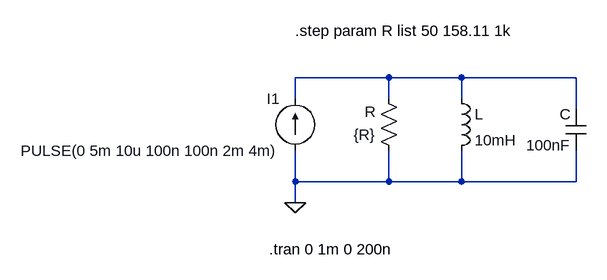
[diagram p0: schematic 06_RLC_paralelo.asc]
06_RLC_paralelo.asc, the LTspice schematic file:
Version 4
SHEET 1 880 680
WIRE 208 112 64 112
WIRE 320 112 208 112
WIRE 496 112 320 112
WIRE 64 144 64 112
WIRE 208 144 208 112
WIRE 320 144 320 112
WIRE 496 160 496 112
WIRE 64 272 64 224
WIRE 208 272 208 224
WIRE 208 272 64 272
WIRE 320 272 320 224
WIRE 320 272 208 272
WIRE 496 272 496 224
WIRE 496 272 320 272
WIRE 64 304 64 272
FLAG 64 304 0
SYMBOL ind 304 128 R0
SYMATTR InstName L
SYMATTR Value 10mH
SYMBOL res 224 240 R180
WINDOW 0 36 76 Left 2
WINDOW 3 36 40 Left 2
SYMATTR InstName R
SYMATTR Value {R}
SYMBOL cap 512 224 R180
WINDOW 0 24 56 Left 2
WINDOW 3 24 8 Left 2
SYMATTR InstName C
SYMATTR Value 100nF
SYMBOL current 64 224 R180
WINDOW 0 24 80 Left 2
WINDOW 3 24 0 Left 2
WINDOW 123 0 0 Left 0
WINDOW 39 0 0 Left 0
SYMATTR InstName I1
SYMATTR Value PULSE(0 5m 10u 100n 100n 2m 4m)
TEXT 24 376 Left 2 !.tran 0 1m 0 200n
TEXT 64 40 Left 2 !.step param R list 50 158.11 1k

The netlist it stands for:
* 06_RLC_paralelo.asc
L N001 0 10mH
R 0 N001 {R}
C 0 N001 100nF
I1 0 N001 PULSE(0 5m 10u 100n 100n 2m 4m)
.tran 0 1m 0 200n
.step param R list 50 158.11 1k
.backanno
.end